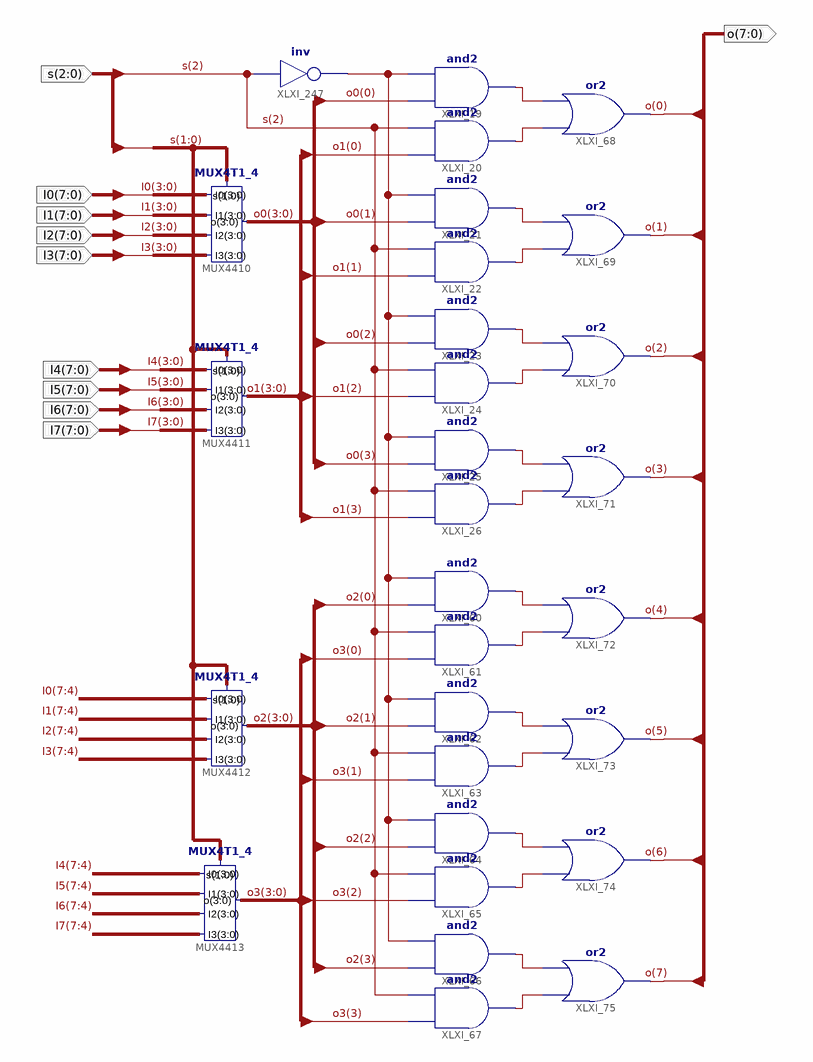
[diagram p0: schematic sheet 1]
// Xilinx ISE schematic MUX8T1_8.sch (kintex7) as structural Verilog: 29 symbols, 10 ports
module MUX8T1_8 (
  input  [2:0] s,
  input  [7:0] I3,
  input  [7:0] I2,
  input  [7:0] I1,
  input  [7:0] I0,
  input  [7:0] I7,
  input  [7:0] I6,
  input  [7:0] I5,
  input  [7:0] I4,
  output [7:0] o
);

  wire XLXN_22, XLXN_42, XLXN_43, XLXN_44, XLXN_45, XLXN_46, XLXN_47, XLXN_48, XLXN_49, XLXN_141, XLXN_142,
       XLXN_143, XLXN_144, XLXN_155, XLXN_156, XLXN_157, XLXN_158;
  wire [3:0] o0, o1, o2, o3;

  and XLXI_19 (XLXN_42, o0[0], XLXN_22);
  and XLXI_20 (XLXN_43, o1[0], s[2]);
  or XLXI_68 (o[0], XLXN_43, XLXN_42);
  and XLXI_21 (XLXN_44, o0[1], XLXN_22);
  or XLXI_69 (o[1], XLXN_45, XLXN_44);
  and XLXI_22 (XLXN_45, o1[1], s[2]);
  or XLXI_70 (o[2], XLXN_47, XLXN_46);
  and XLXI_23 (XLXN_46, o0[2], XLXN_22);
  and XLXI_24 (XLXN_47, o1[2], s[2]);
  MUX4T1_4 MUX4411 (.I3(I7[3:0]), .I2(I6[3:0]), .I1(I5[3:0]), .I0(I4[3:0]), .s(s[1:0]), .o(o1));
  and XLXI_25 (XLXN_48, o0[3], XLXN_22);
  or XLXI_71 (o[3], XLXN_49, XLXN_48);
  and XLXI_26 (XLXN_49, o1[3], s[2]);
  or XLXI_72 (o[4], XLXN_142, XLXN_141);
  and XLXI_60 (XLXN_141, o2[0], XLXN_22);
  and XLXI_61 (XLXN_142, o3[0], s[2]);
  or XLXI_73 (o[5], XLXN_144, XLXN_143);
  and XLXI_62 (XLXN_143, o2[1], XLXN_22);
  and XLXI_63 (XLXN_144, o3[1], s[2]);
  MUX4T1_4 MUX4412 (.I3(I3[7:4]), .I2(I2[7:4]), .I1(I1[7:4]), .I0(I0[7:4]), .s(s[1:0]), .o(o2));
  not XLXI_247 (XLXN_22, s[2]);
  and XLXI_64 (XLXN_155, o2[2], XLXN_22);
  or XLXI_74 (o[6], XLXN_156, XLXN_155);
  and XLXI_65 (XLXN_156, o3[2], s[2]);
  and XLXI_66 (XLXN_157, o2[3], XLXN_22);
  or XLXI_75 (o[7], XLXN_158, XLXN_157);
  MUX4T1_4 MUX4413 (.I3(I7[7:4]), .I2(I6[7:4]), .I1(I5[7:4]), .I0(I4[7:4]), .s(s[1:0]), .o(o3));
  and XLXI_67 (XLXN_158, o3[3], s[2]);
  MUX4T1_4 MUX4410 (.I3(I3[3:0]), .I2(I2[3:0]), .I1(I1[3:0]), .I0(I0[3:0]), .s(s[1:0]), .o(o0));
endmodule
